# Altium schematic sheet CCU_Sheet.SchDoc
size 420 x 297 mm; SheetNumber: 2; SheetTotal: 4
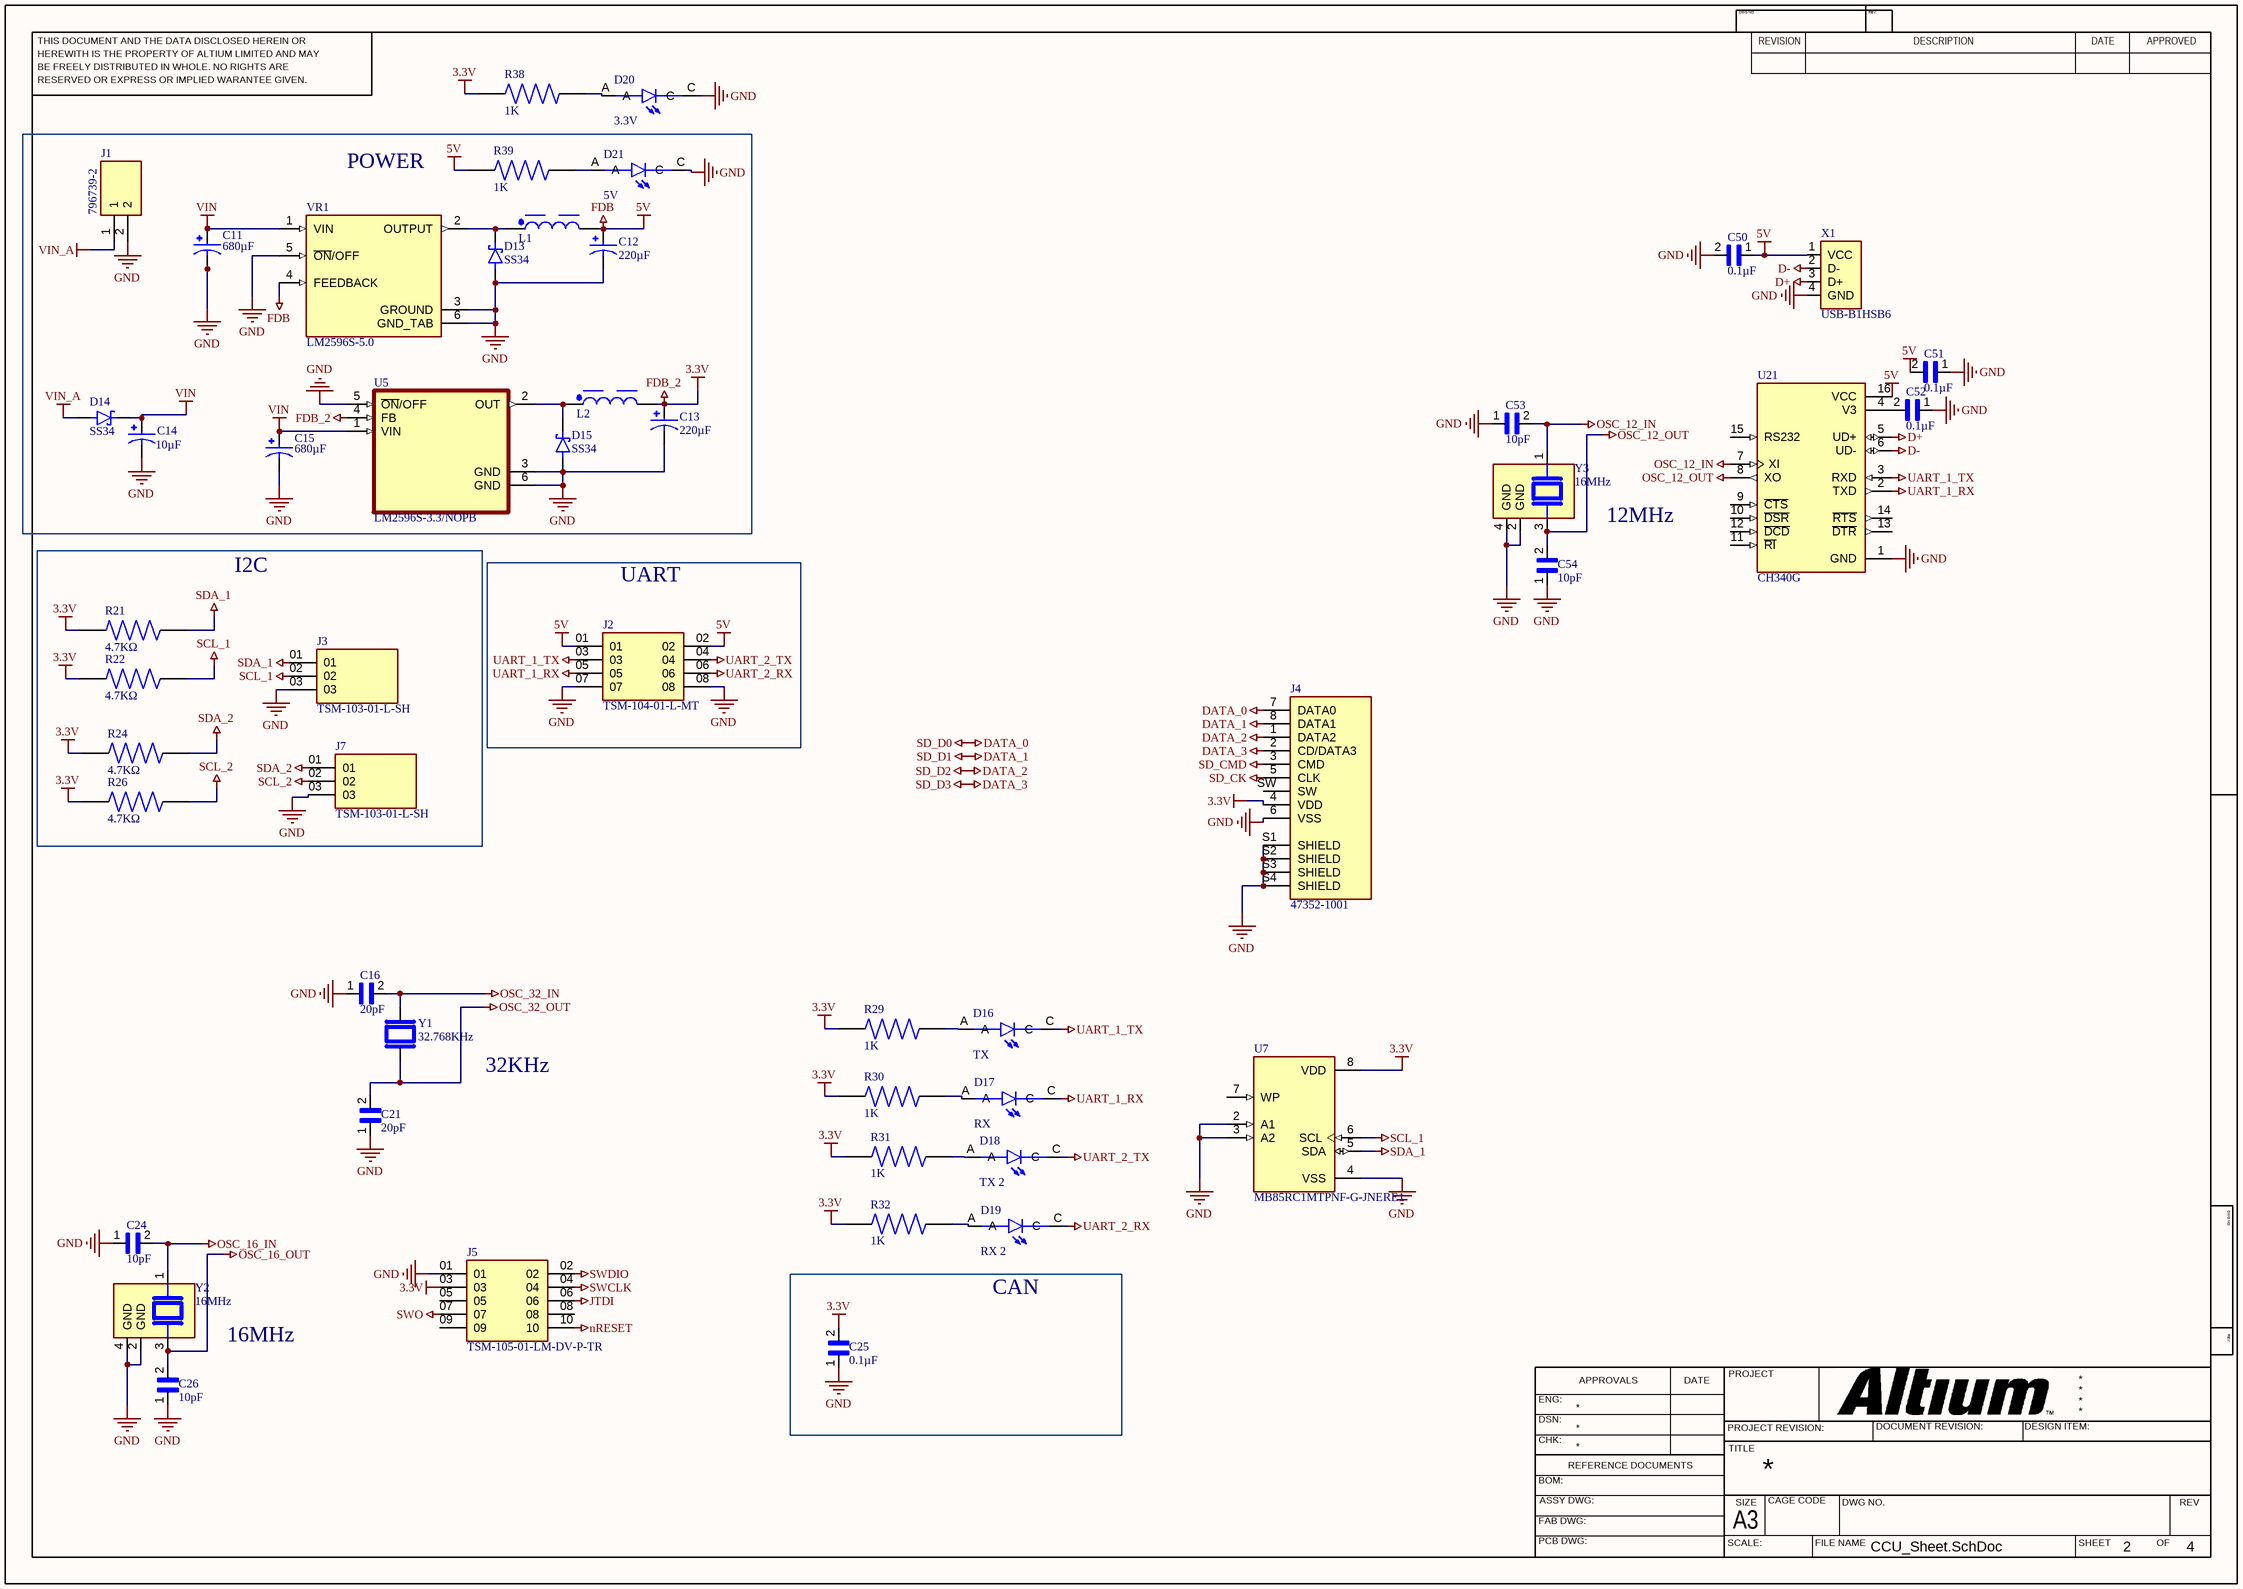
[diagram p0: CCU_Sheet.SchDoc]

## Parts
C11  680µF  [CAP_EEEFN1E681UV]
C12  220µF  [CAP_EEEFP1V221AV]
C13  220µF  [CAP_EEEFP1V221AV]
C14  10µF  [CAPPRD500W50D500H1100]
C15  680µF  [CAP_EEEFN1E681UV]
C16  20pF  [CAPC1005X61N]
C21  20pF  [CAPC1005X61N]
C24  10pF  [CAPC1005X61N]
C25  0.1µF  [CAPC1608X90N]
C26  10pF  [CAPC1005X61N]
C50  0.1µF  [CAPC1608X90N]
C51  0.1µF  [CAPC1608X90N]
C52  0.1µF  [CAPC1608X90N]
C53  10pF  [CAPC1005X61N]
C54  10pF  [CAPC1005X61N]
D13  SS34  [DIO_SS34]
D14  SS34  [DIO_SS34]
D15  SS34  [DIO_SS34]
D16  TX  [LEDC2012X70N]
D17  RX  [LEDC2012X70N]
D18  TX 2  [LEDC2012X70N]
D19  RX 2  [LEDC2012X70N]
D20  3.3V  [LEDC2012X70N]
D21  5V  [LEDC2012X70N]
J1  796739-2  [TE_796739-2]
J2  TSM-104-01-L-MT  [SAMTEC_TSM-104-01-L-MT]
J3  TSM-103-01-L-SH  [SAMTEC_TSM-103-01-L-SH]
J4  47352-1001  [MOLEX_47352-1001]
J5  TSM-105-01-LM-DV-P-TR  [SAMTEC_TSM-105-01-LM-DV-P-TR]
J7  TSM-103-01-L-SH  [SAMTEC_TSM-103-01-L-SH]
L1  33uH, 4.2A  [WE-PD_1210]  (value not drawn)
L2  33uH, 4.2A  [WE-PD_1210]  (value not drawn)
R21  4.7KΩ  [RES_ERJS06J472V]
R22  4.7KΩ  [RES_ERJS06J472V]
R24  4.7KΩ  [RES_ERJS06J472V]
R26  4.7KΩ  [RES_ERJS06J472V]
R29  1K  [RESC3116X65N]
R30  1K  [RESC3116X65N]
R31  1K  [RESC3116X65N]
R32  1K  [RESC3116X65N]
R38  1K  [RESC3116X65N]
R39  1K  [RESC3116X65N]
U5  LM2596S-3.3/NOPB  [VREG_LM2596S-3.3/NOPB]
U7  MB85RC1MTPNF-G-JNERE1  [SOIC127P600X175-8N]
U21  CH340G  [SOIC127P600X180-16N]
VR1  LM2596S-5.0  [TO170P1524X483-6N]
X1  USB-B1HSB6  [OST_USB-B1HSB6]
Y1  32.768KHz  [XTAL_ABS06-32.768KHZ-9-1-T]
Y2  16MHz  [XTAL_7M25090002]
Y3  16MHz  [XTAL_7M25090002]

## Blocks framed on the sheet
POWER: C11-C15 D13-D15 D21 J1 L1 L2 R39 U5 VR1
I2C: J3 J7 R21 R22 R24 R26
UART: J2
CAN: C25

## Nets
3.3V: C13.1 C25.2 J4.4(VDD) J5.03 L2.2 R21.2 R22.1 R24.2 R26.1 R29.1 R30.1 R31.1 R32.1 R38.1 U5.4(FB) U7.8(VDD)  [also labelled FDB_2]
5V: C12.1 C50.1 C51.2 J2.01 J2.02 L1.2 R39.1 U21.16(VCC) VR1.4(FEEDBACK) X1.1(VCC)  [also labelled FDB]
D+: U21.5(UD+) X1.3(D+)
D-: U21.6(UD-) X1.2(D-)
DATA_0: J4.7(DATA0)  [also labelled SD_D0]
DATA_1: J4.8(DATA1)  [also labelled SD_D1]
DATA_2: J4.1(DATA2)  [also labelled SD_D2]
DATA_3: J4.2(CD/DATA3)  [also labelled SD_D3]
GND: C11.2 C12.2 C13.2 C14.N C15.2 C16.1 C21.1 C24.1 C25.1 C26.1 C50.2 C51.1 C52.1 C53.1 C54.1 D13.A D15.A D20.C D21.C J1.2 J2.07 J2.08 J3.03 J4.6(VSS) J4.S1(SHIELD) J4.S2(SHIELD) J4.S3(SHIELD) J4.S4(SHIELD) J5.01 J7.03 U5.3(GND) U5.5(~{ON}/OFF) U5.6(GND) U7.2(A1) U7.3(A2) U7.4(VSS) U21.1(GND) VR1.3(GROUND) VR1.5(~{ON}/OFF) VR1.6(GND_TAB) X1.4(GND) Y2.2(GND) Y2.4(GND) Y3.2(GND) Y3.4(GND)
JTDI: J5.06
nRESET: J5.10
OSC_12_IN: C53.2 U21.7(XI) Y3.1
OSC_12_OUT: C54.2 U21.8(XO) Y3.3
OSC_16_IN: C24.2 Y2.1
OSC_16_OUT: C26.2 Y2.3
OSC_32_IN: C16.2 Y1.2
OSC_32_OUT: C21.2 Y1.1
SCL_1: J3.02 R22.2 U7.6(SCL)
SCL_2: J7.02 R26.2
SD_CK: J4.5(CLK)
SD_CMD: J4.3(CMD)
SDA_1: J3.01 R21.1 U7.5(SDA)
SDA_2: J7.01 R24.1
SWCLK: J5.04
SWDIO: J5.02
SWO: J5.07
UART_1_RX: D17.C J2.05 U21.2(TXD)
UART_1_TX: D16.C J2.03 U21.3(RXD)
UART_2_RX: D19.C J2.06
UART_2_TX: D18.C J2.04
VIN: C11.1 C14.P C15.1 D14.C(K) U5.1(VIN) VR1.1(VIN)
VIN_A: D14.A J1.1
NetC52_2: C52.2 U21.4(V3)
NetD13_C: D13.C(K) L1.1 VR1.2(OUTPUT)
NetD15_C: D15.C(K) L2.1 U5.2(OUT)
NetD16_A: D16.A R29.2
NetD17_A: D17.A R30.2
NetD18_A: D18.A R31.2
NetD19_A: D19.A R32.2
NetD20_A: D20.A R38.2
NetD21_A: D21.A R39.2

Not connected (* = marked no-connect by the designer): J4 SW; J5 05 08 09; U7 7(WP); U21 9(~{CTS}) 10(~{DSR}) 11(~{RI}) 12(~{DCD}) 13(~{DTR}) 14(~{RTS}) 15(RS232)

## Notes on the sheet
- 12MHz
- 32KHz
- 16MHz
- THIS DOCUMENT AND THE DATA DISCLOSED HEREIN OR
- HEREWITH IS THE PROPERTY OF ALTIUM LIMITED AND MAY
- DWG NO:
- REVISION
- REV:
- DESCRIPTION
- DATE
- APPROVED
- BE FREELY DISTRIBUTED IN WHOLE. NO RIGHTS ARE
- RESERVED OR EXPRESS OR IMPLIED WARANTEE GIVEN.
- ENG:
- APPROVALS
- PROJECT
- DSN:
- CHK:
- REFERENCE DOCUMENTS
- PROJECT REVISION:
- TITLE
- DOCUMENT REVISION:
- DESIGN ITEM:
- BOM:
- FAB DWG:
- PCB DWG:
- ASSY DWG:
- SCALE:
- A3
- SIZE
- CAGE CODE
- FILE NAME
- DWG NO.
- SHEET
- OF
- REV

## Library data of the parts
C11 C15 = EEEFN1E681UV: CAP ALUM 680UF 20% 25V SMD; MF: Panasonic Electronic Components; MP: EEE-FN1E681UV; Value: *; Purchase-URL: https://pricing.snapeda.com/search/part/EEE-FN1E681UV/?ref=eda; Price: None; Check_prices: https://www.snapeda.com/parts/EEE-FN1E681UV/Panasonic/view-part/6178425/?ref=eda; Package: RADIAL-2 Panasonic; Availability: In Stock; SnapEDA_Link: https://www.snapeda.com/parts/EEE-FN1E681UV/Panasonic/view-part/6178425/?ref=snap
C12 C13 = EEEFP1V221AV: CAP ALUM 220UF 20% 35V SMD; MF: Panasonic Electronic Components; MP: EEE-FP1V221AV; SnapEDA_Link: https://www.snapeda.com/parts/EEE-FP1V221AV/Panasonic/view-part/4900934/?ref=snap; Price: None; Availability: Not in stock; Value: *; Check_prices: https://www.snapeda.com/parts/EEE-FP1V221AV/Panasonic/view-part/4900934/?ref=eda; Package: RADIAL-2 Panasonic
C14 = ECEA1EN100UB: 10ÂµF 25V Aluminum Electrolytic Capacitors Radial, Can 2000 Hrs @ 85Â°C; MF: Panasonic; SnapEDA_Link: https://www.snapeda.com/parts/ECEA1EN100UB/Panasonic/view-part/?ref=snap; Price: None; Check_prices: https://www.snapeda.com/parts/ECEA1EN100UB/Panasonic/view-part/?ref=eda; Purchase-URL: https://pricing.snapeda.com/search/part/ECEA1EN100UB/?ref=eda; Package: RADIAL-2 Panasonic; MP: ECEA1EN100UB; Value: *; Availability: In Stock
C16 C21 C24 C26 C53 C54 = VJ0402D200FXAAJ: Package: None; Price: None; Value: *; MP: VJ0402D200FXAAJ; Availability: Unavailable
C25 C50-C52 = 06035C104MAZ2A: Multilayer Ceramic Capacitors MLCC - SMD/SMT; Package: None; Price: None; Value: *; MP: 06035C104MAZ2A; Availability: Unavailable
D13-D15 = SS34: 3A, 40V, Schottky Rectifier; MF: Taiwan Semiconductor; SnapEDA_Link: https://www.snapeda.com/parts/SS34/Taiwan+Semiconductor/view-part/?ref=snap; Package: DO-214AB-2 Taiwan Semiconductor; Value: *; MP: SS34; Check_prices: https://www.snapeda.com/parts/SS34/Taiwan+Semiconductor/view-part/?ref=eda
D16-D21 = 597-3305-607F: LED Uni-Color Green 4-Pin Chip 0805 T/R; Availability: Unavailable; Value: *; Price: None; MP: 597-3305-607F; Package: None
J1 = 796739-2: Conn Terminal Block F 2 POS 9.53mm Solder RA Thru-Hole 32A/Contact; MF: TE Connectivity; Number_of_Positions: 2; Centerline_Pitch: 9.53 mm[.375 in]; Package: None; Value: *; Price: None; EU_RoHS_Compliance: Compliant with Exemptions; MP: 796739-2; TE_purchase_URL: https://www.te.com/usa-en/product-796739-2.html?te_bu=Cor&te_type=disp&te_campaign=seda_glo_cor-seda-global-disp-prtnr-fy19-seda-model-bom-cta_sma-317_1&elqCampaignId=32493; Availability: Unavailable; SnapEDA_Link: https://www.snapeda.com/parts/796739-2/TE%20Connectivity%20AMP%20Connectors/view-part/279084/?ref=snap
J2 = TSM-104-01-L-MT: TSM Series .100 Surface Mount Terminal Strip; MF: Samtec; SnapEDA_Link: https://www.snapeda.com/parts/TSM-104-01-L-MT/Samtec/view-part/?ref=snap; Package: None; Value: *; MP: TSM-104-01-L-MT; Check_prices: https://www.snapeda.com/parts/TSM-104-01-L-MT/Samtec/view-part/?ref=eda
J3 J7 = TSM-103-01-L-SH: MF: Samtec Inc.; Package: None; MP: TSM-103-01-L-SH; Value: *; Price: None; Availability: Unavailable
J4 = 47352-1001: 8 (6 + 2) Position Card Connector Secure Digital - microSDâ„¢ Surface Mount, Right Angle Gold; MP: 473521001; MF: Molex; Price: None; Availability: In Stock; Package: None; Value: *; Purchase-URL: https://pricing.snapeda.com/search/part/473521001/?ref=eda
J5 = TSM-105-01-LM-DV-P-TR: TSM - Samtec 2.54mm Dual Row Vertical Surface Mount Header 5.84mm Post Height (01) - Fast Stock; Check_prices: https://www.snapeda.com/parts/TSM-105-01-LM-DV-P-TR/Samtec/view-part/3284031/?ref=eda; MF: Samtec; Package: None; Purchase-URL: https://pricing.snapeda.com/search/part/TSM-105-01-LM-DV-P-TR/?ref=eda; Availability: In Stock; Value: *; MP: TSM-105-01-LM-DV-P-TR; SnapEDA_Link: https://www.snapeda.com/parts/TSM-105-01-LM-DV-P-TR/Samtec/view-part/3284031/?ref=snap; Price: None
L1 L2 = 7447709330: WE-PD SMT Power Inductor, size 1210, 33uH, 4.2A, 45mOhm; Manufacturer: Wurth Elektronik; Case/Size Code: 1210; DC Resistance: 37mOhm; Saturation Current: 5.5A; Self Resonant Frequency: 8.5MHz; Type: Standard; Manufacturer Part Number: 7447709330; Category: Power Inductors; Match Code: WE-PD; ComponentLink1Description: Website Link; ComponentLink1URL: https://www.we-online.com/redexpert/article/7447709330?ad; ComponentLink2Description: Datasheet Link; ComponentLink2URL: https://www.we-online.com/redexpert/spec/7447709330?ad; Mount: Surface Mount; Operating Temperature Max: 125°C; Operating Temperature Min: -40°C; Packaging: Tape and Reel; Length: 12mm; Width: 12mm; Height: 10mm; DC Resistance Max: 45mOhm; Inductance: 33uH; Rated Current: 4.2A
R21 R22 R24 R26 = ERJS06J472V: Price: None; Availability: Unavailable; MP: ERJS06J472V; Package: None; Value: *
R29-R32 R38 R39 = RC1206JR-071KL: RES, THICK FILM, 1K, 5%, 0.25W, 1206; Resistance:1kohm; Resistance Tolerance:Â± 5%; Power Rating:250mW; Resistor Case Style:1206 ^3216 Metric]; Resistor Technology:Thick Film; Resistor Type:General Purpose; Product Range:RC Series; MF: Yageo Corporation; MP: RC1206JR071KL; SnapEDA_Link: https://www.snapeda.com/parts/RC1206JR071KL/Yageo/view-part/?ref=snap; Package: 1206-2 YAGEO; Value: *; Check_prices: https://www.snapeda.com/parts/RC1206JR071KL/Yageo/view-part/?ref=eda
U7 = MB85RC1MTPNF-G-JNERE1: FRAM _Ferroelectric RAM_ Memory IC 1Mb _128K x 8_ IÂ²C 3.4MHz 130ns 8-SOP; MF: Fujitsu Electronics; MP: MB85RC1MTPNF-G-JNERE1; Price: None; SnapEDA_Link: https://www.snapeda.com/parts/MB85RC1MTPNF-G-JNERE1/Fujitsu%20Electronics%20America%2C%20Inc./view-part/2842124/?ref=snap; Availability: Unavailable; Value: *; Package: SO-8 Fujitsu
U21 = CH340G: USB Interface Integrated Circuit; MF: WCH; Value: *; SnapEDA_Link: https://www.snapeda.com/parts/Ch340G/WCH/view-part/?ref=snap; MP: Ch340G; Check_prices: https://www.snapeda.com/parts/Ch340G/WCH/view-part/?ref=eda; Availability: Not in stock; Price: None; Package: None
VR1 = LM2596S-5.0: SIMPLE SWITCHER&reg; 4.5V to 40V, 3A Low Component Count Step-Down Regulator; MP: LM2596S-5.0/NOPB; MF: Texas Instruments; Price: None; Availability: In Stock; Package: TO-263-5 Texas Instruments; SnapEDA_Link: https://www.snapeda.com/parts/LM2596S-5.0/NOPB/Texas+Instruments/view-part/?ref=snap; Check_prices: https://www.snapeda.com/parts/LM2596S-5.0/NOPB/Texas+Instruments/view-part/?ref=eda; Value: *; Purchase-URL: https://pricing.snapeda.com/search/part/LM2596S-5.0/NOPB/?ref=eda
X1 = USB-B1HSB6: USB-B (USB TYPE-B) - Receptacle Connector 4 Position Through Hole, Right Angle; MF: On Shore; Check_prices: https://www.snapeda.com/parts/USB-B1HSB6/On+Shore+Technology+Inc./view-part/?ref=eda; Value: *; Purchase-URL: https://pricing.snapeda.com/search/part/USB-B1HSB6/?ref=eda; Price: None; MP: USB-B1HSB6; SnapEDA_Link: https://www.snapeda.com/parts/USB-B1HSB6/On+Shore+Technology+Inc./view-part/?ref=snap; Availability: In Stock; Package: None
Y1 = ABS06-32.768KHZ-9-1-T: 32.768 kHz Â±10ppm Crystal 9pF 90 kOhms 2-SMD, No Lead; MF: Abracon; Availability: In Stock; Value: *; Purchase-URL: https://pricing.snapeda.com/search/part/ABS06-32.768KHZ-9-1-T/?ref=eda; Price: None; Check_prices: https://www.snapeda.com/parts/ABS06-32.768KHZ-9-1-T/Abracon+LLC/view-part/?ref=eda; MP: ABS06-32.768KHZ-9-1-T; Package: SMD-2 Abracon LLC; SnapEDA_Link: https://www.snapeda.com/parts/ABS06-32.768KHZ-9-1-T/Abracon+LLC/view-part/?ref=snap
Y2 Y3 = 7M25090002: 25 MHz Â±10ppm Crystal 18pF 4-SMD, No Lead; MF: TXC; Availability: In Stock; Check_prices: https://www.snapeda.com/parts/7M25090002/TXC/view-part/?ref=eda; Price: None; SnapEDA_Link: https://www.snapeda.com/parts/7M25090002/TXC/view-part/?ref=snap; MP: 7M25090002; Value: *; Purchase-URL: https://pricing.snapeda.com/search/part/7M25090002/?ref=eda; Package: SMD-4 TXC
U5 = LM2596S-3.3/NOPB: MP: LM2596S-3.3/NOPB; Availability: Unavailable; Package: None; Value: *; Price: None